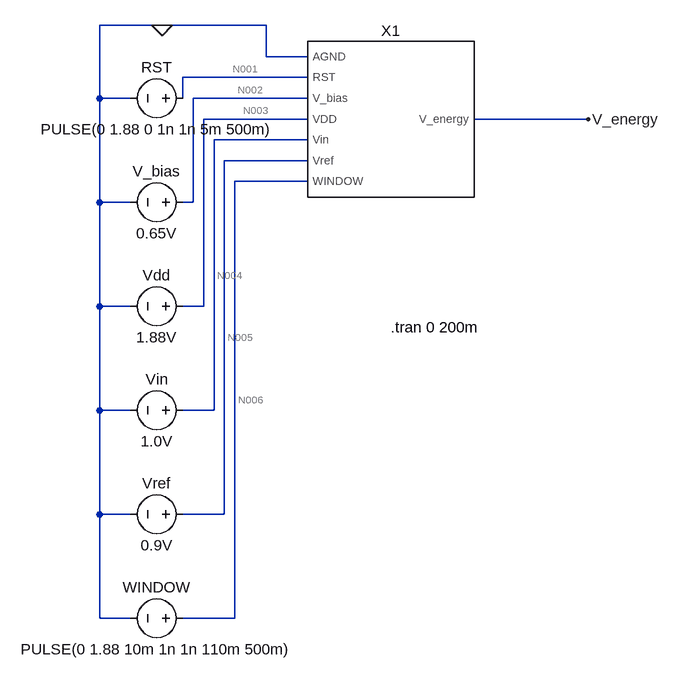
[diagram p0: schematic gated_integrator_test.asc]
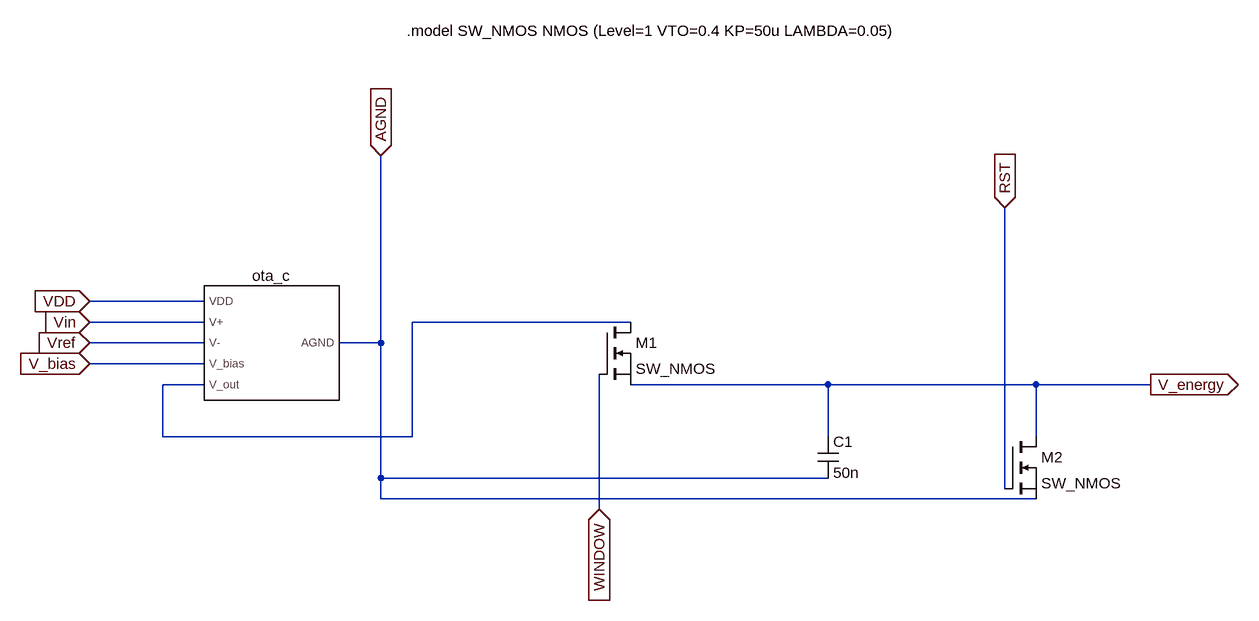
[diagram p1: sub-circuit gated_integrator.asc]
gated_integrator_test.asc, the LTspice schematic file:
Version 4.1
SHEET 1 880 1008
WIRE -112 32 -208 32
WIRE 48 32 -112 32
WIRE 48 80 48 32
WIRE 112 80 48 80
WIRE 112 112 -80 112
WIRE -208 144 -208 32
WIRE -160 144 -208 144
WIRE -80 144 -80 112
WIRE 112 144 -64 144
WIRE 112 176 -48 176
WIRE 544 176 368 176
WIRE 112 208 -32 208
WIRE 112 240 -16 240
WIRE 112 272 0 272
WIRE -208 304 -208 144
WIRE -160 304 -208 304
WIRE -64 304 -64 144
WIRE -64 304 -80 304
WIRE -208 464 -208 304
WIRE -160 464 -208 464
WIRE -48 464 -48 176
WIRE -48 464 -80 464
WIRE -208 624 -208 464
WIRE -160 624 -208 624
WIRE -32 624 -32 208
WIRE -32 624 -80 624
WIRE -208 784 -208 624
WIRE -160 784 -208 784
WIRE -16 784 -16 240
WIRE -16 784 -80 784
WIRE -208 944 -208 784
WIRE -160 944 -208 944
WIRE 0 944 0 272
WIRE 0 944 -80 944
FLAG -112 32 0
FLAG 544 176 V_energy
SYMBOL voltage -64 144 R90
WINDOW 0 -32 56 VBottom 2
WINDOW 3 32 56 VTop 2
WINDOW 123 0 0 Left 0
WINDOW 39 0 0 Left 0
SYMATTR InstName RST
SYMATTR Value PULSE(0 1.88 0 1n 1n 5m 500m)
SYMBOL voltage -64 304 R90
WINDOW 0 -32 56 VBottom 2
WINDOW 3 32 56 VTop 2
SYMATTR InstName V_bias
SYMATTR Value 0.65V
SYMBOL voltage -64 464 R90
WINDOW 0 -32 56 VBottom 2
WINDOW 3 32 56 VTop 2
SYMATTR InstName Vdd
SYMATTR Value 1.88V
SYMBOL voltage -64 624 R90
WINDOW 0 -32 56 VBottom 2
WINDOW 3 32 56 VTop 2
SYMATTR InstName Vin
SYMATTR Value 1.0V
SYMBOL voltage -64 784 R90
WINDOW 0 -32 56 VBottom 2
WINDOW 3 32 56 VTop 2
SYMATTR InstName Vref
SYMATTR Value 0.9V
SYMBOL voltage -64 944 R90
WINDOW 0 -32 56 VBottom 2
WINDOW 3 32 56 VTop 2
WINDOW 123 0 0 Left 0
WINDOW 39 0 0 Left 0
SYMATTR InstName WINDOW
SYMATTR Value PULSE(0 1.88 10m 1n 1n 110m 500m)
SYMBOL gated_integrator 240 176 R0
SYMATTR InstName X1
TEXT 240 496 Left 2 !.tran 0 200m

gated_integrator.asc, the sub-circuit schematic file:
Version 4.1
SHEET 1 1656 680
WIRE 32 112 -144 112
WIRE 32 144 -144 144
WIRE 688 144 352 144
WIRE 32 176 -144 176
WIRE 304 176 304 -112
WIRE 304 176 240 176
WIRE 32 208 -144 208
WIRE 32 240 -32 240
WIRE 992 240 688 240
WIRE 1312 240 992 240
WIRE 1488 240 1312 240
WIRE -32 320 -32 240
WIRE 352 320 352 144
WIRE 352 320 -32 320
WIRE 992 320 992 240
WIRE 1312 320 1312 240
WIRE 304 384 304 176
WIRE 992 384 304 384
WIRE 1264 400 1264 -32
WIRE 304 416 304 384
WIRE 1312 416 304 416
WIRE 640 432 640 224
FLAG -144 144 Vin
IOPIN -144 144 In
FLAG -144 176 Vref
IOPIN -144 176 In
FLAG -144 112 VDD
IOPIN -144 112 In
FLAG -144 208 V_bias
IOPIN -144 208 In
FLAG 304 -112 AGND
IOPIN 304 -112 In
FLAG 1488 240 V_energy
IOPIN 1488 240 Out
FLAG 640 432 WINDOW
IOPIN 640 432 In
FLAG 1264 -32 RST
IOPIN 1264 -32 In
SYMBOL ota_core 128 176 R0
SYMATTR InstName ota_c
SYMBOL nmos 640 144 R0
SYMATTR InstName M1
SYMATTR Value SW_NMOS
SYMBOL nmos 1264 320 R0
SYMATTR InstName M2
SYMATTR Value SW_NMOS
SYMBOL cap 976 320 R0
SYMATTR InstName C1
SYMATTR Value 50n
TEXT 344 -304 Left 2 !.model SW_NMOS NMOS (Level=1 VTO=0.4 KP=50u LAMBDA=0.05)

The netlist it stands for:
* gated_integrator_test.asc
V§RST N001 0 PULSE(0 1.88 0 1n 1n 5m 500m)
V_bias N002 0 0.65V
Vdd N003 0 1.88V
Vin N004 0 1.0V
Vref N005 0 0.9V
V§WINDOW N006 0 PULSE(0 1.88 10m 1n 1n 110m 500m)
X§X1 0 N001 N002 N003 N004 N005 N006 V_energy gated_integrator

* block symbol definitions
.subckt gated_integrator AGND RST V_bias VDD Vin Vref WINDOW V_energy
X§ota_c VDD Vin Vref V_bias N001 AGND ota_core  ; pins VDD V+ V- V_bias V_out AGND
M1 N001 WINDOW V_energy V_energy SW_NMOS
M2 V_energy RST AGND AGND SW_NMOS
C1 V_energy AGND 50n
.model SW_NMOS NMOS (Level=1 VTO=0.4 KP=50u LAMBDA=0.05)
.ends gated_integrator

.model NMOS NMOS
.model PMOS PMOS
.lib standard.mos
.tran 0 200m
.backanno
.end

* Results of the author's LTspice run, read from the files saved beside the schematic
* Operating Point, zero values left out:
*   V(n002) = 650 mV
*   V(n003) = 1.88 V
*   V(n004) = 1 V
*   V(n005) = 900 mV
*   V(v_energy) = 940 mV
*   I(Vdd) = -321.3 nA
*   Ix(x1:agnd) = -321.3 nA
*   Ix(x1:vdd) = 321.3 nA
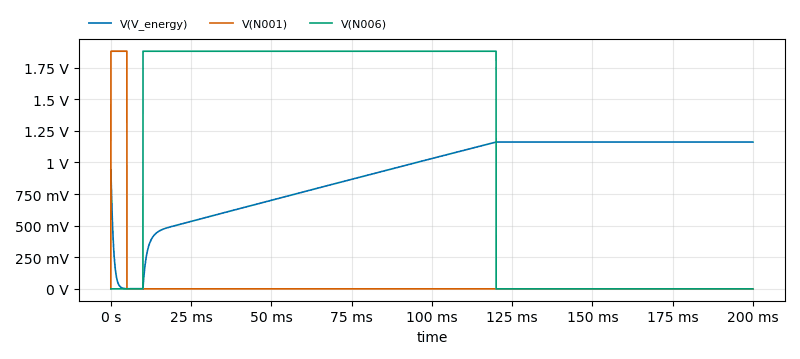
[diagram p2: Transient Analysis of gated_integrator_test.asc, plotted from the saved traces]
* Transient Analysis, 1 run:
*   V(V_energy): min 764.5 µV, max 1.162 V, average 905.3 mV, rms 956.8 mV, last 1.162 V
*   V(N001): min 0 V, max 1.88 V, average 47 mV, rms 297.3 mV, last 0 V
*   V(N006): min 0 V, max 1.88 V, average 1.034 V, rms 1.394 V, last 0 V